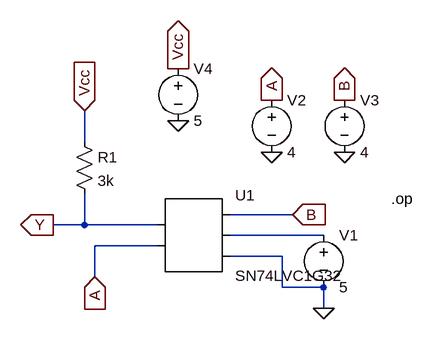
[diagram p0: schematic SN74LVC1G32 (OR).asc]
SN74LVC1G32 (OR).asc, the LTspice schematic file:
Version 4
SHEET 1 924 680
WIRE 224 176 224 128
WIRE 544 288 448 288
WIRE 224 304 224 256
WIRE 224 304 176 304
WIRE 336 304 224 304
WIRE 592 320 448 320
WIRE 336 336 240 336
WIRE 528 352 448 352
WIRE 240 384 240 336
WIRE 528 400 528 352
WIRE 592 400 528 400
WIRE 592 432 592 400
FLAG 240 384 A
IOPIN 240 384 In
FLAG 544 288 B
IOPIN 544 288 In
FLAG 176 304 Y
IOPIN 176 304 Out
FLAG 368 64 Vcc
IOPIN 368 64 Out
FLAG 512 112 A
IOPIN 512 112 Out
FLAG 624 112 B
IOPIN 624 112 Out
FLAG 592 432 0
FLAG 512 192 0
FLAG 624 192 0
FLAG 368 144 0
FLAG 224 128 Vcc
IOPIN 224 128 In
SYMBOL AutoGenerated/SN74LVC1G32 384 320 R0
SYMATTR InstName U1
SYMBOL voltage 592 304 R0
SYMATTR InstName V1
SYMATTR Value 5
SYMBOL voltage 512 96 R0
SYMATTR InstName V2
SYMATTR Value 4
SYMBOL voltage 624 96 R0
SYMATTR InstName V3
SYMATTR Value 4
SYMBOL voltage 368 48 R0
SYMATTR InstName V4
SYMATTR Value 5
SYMBOL res 208 160 R0
SYMATTR InstName R1
SYMATTR Value 3k
TEXT 696 264 Left 2 !.op

The netlist it stands for:
* SN74LVC1G32 (OR).asc
* U1: SN74LVC1G32 (symbol AutoGenerated/SN74LVC1G32 not available, pins judged from their places): pin1=Y pin2=A pin3=B pin4=N001 pin5=0
V1 N001 0 5
V2 A 0 4
V3 B 0 4
V4 Vcc 0 5
R1 Vcc Y 3k
.op
.backanno
.end